# Altium schematic sheet Multiplier.SchDoc
size A; SheetNumber: 3; SheetTotal: 6
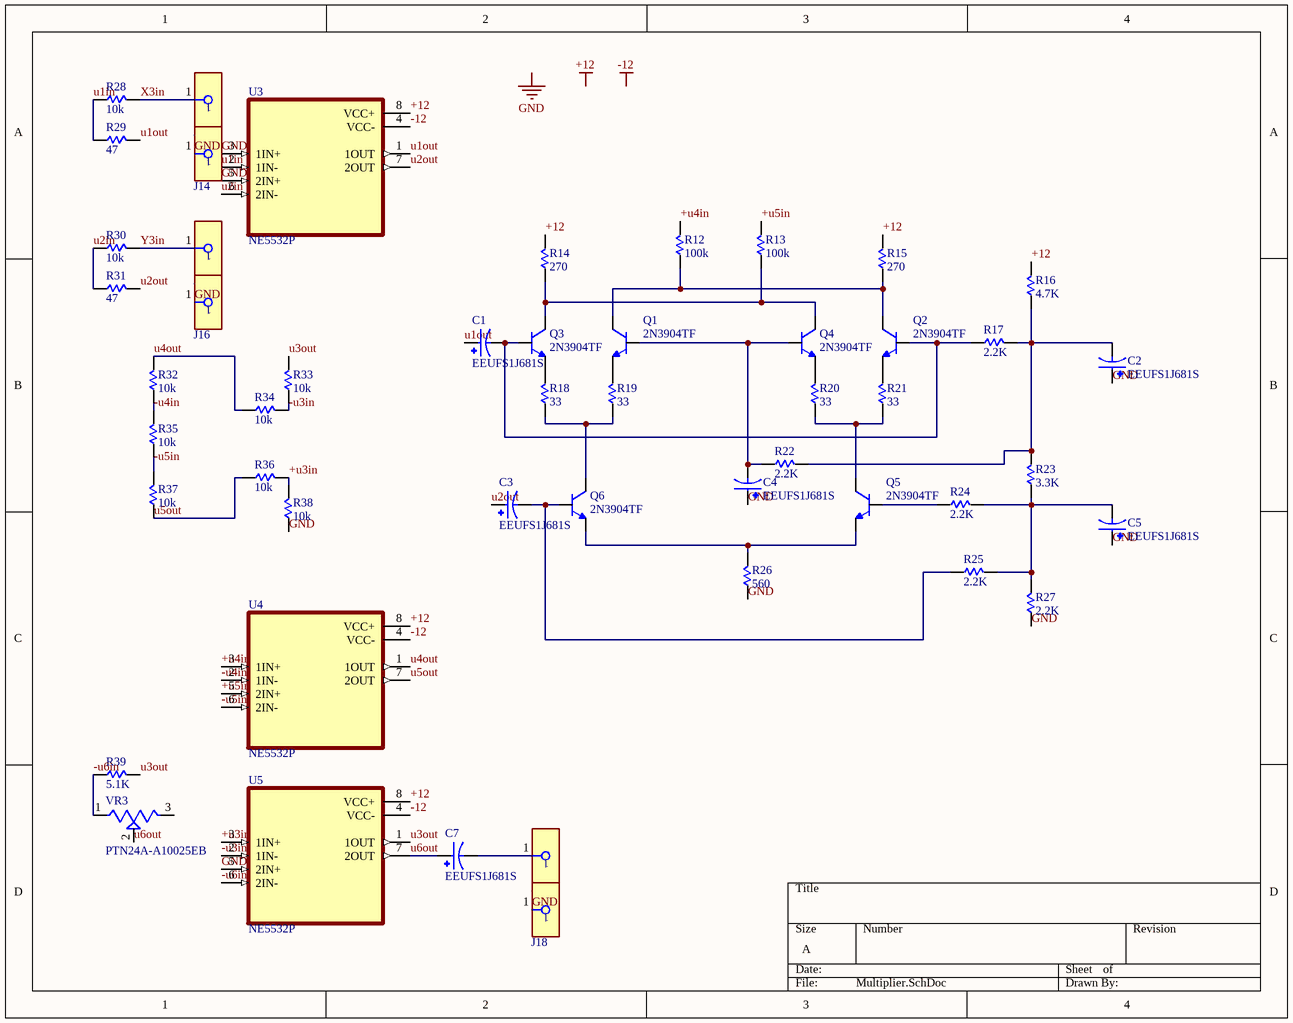
[diagram p0: Multiplier.SchDoc]

## Parts
C1  EEUFS1J681S  [CAPPRD250W50D630H1250]
C2  EEUFS1J681S  [CAPPRD250W50D630H1250]
C3  EEUFS1J681S  [CAPPRD250W50D630H1250]
C4  EEUFS1J681S  [CAPPRD250W50D630H1250]
C5  EEUFS1J681S  [CAPPRD250W50D630H1250]
C7  EEUFS1J681S  [CAPPRD250W50D630H1250]
J13  1581-5  [FP-1581-5-MFG]  (value not drawn)
J14  1581-5  [FP-1581-5-MFG]  (value not drawn)
J15  1581-5  [FP-1581-5-MFG]  (value not drawn)
J16  1581-5  [FP-1581-5-MFG]  (value not drawn)
J17  1581-5  [FP-1581-5-MFG]  (value not drawn)
J18  1581-5  [FP-1581-5-MFG]  (value not drawn)
Q1  2N3904TF  [TO92254P520H877-3]
Q2  2N3904TF  [TO92254P520H877-3]
Q3  2N3904TF  [TO92254P520H877-3]
Q4  2N3904TF  [TO92254P520H877-3]
Q5  2N3904TF  [TO92254P520H877-3]
Q6  2N3904TF  [TO92254P520H877-3]
R12  value 100k  [RESAD1100W55L680D260]  (hidden comment: MFR-25FBF52-1K)
R13  value 100k  [RESAD1100W55L680D260]  (hidden comment: MFR-25FBF52-1K)
R14  value 270  [RESAD1100W55L680D260]  (hidden comment: MFR-25FBF52-1K)
R15  value 270  [RESAD1100W55L680D260]  (hidden comment: MFR-25FBF52-1K)
R16  value 4.7K  [RESAD1100W55L680D260]  (hidden comment: MFR-25FBF52-1K)
R17  value 2.2K  [RESAD1100W55L680D260]  (hidden comment: MFR-25FBF52-1K)
R18  value 33  [RESAD1100W55L680D260]  (hidden comment: MFR-25FBF52-1K)
R19  value 33  [RESAD1100W55L680D260]  (hidden comment: MFR-25FBF52-1K)
R20  value 33  [RESAD1100W55L680D260]  (hidden comment: MFR-25FBF52-1K)
R21  value 33  [RESAD1100W55L680D260]  (hidden comment: MFR-25FBF52-1K)
R22  value 2.2K  [RESAD1100W55L680D260]  (hidden comment: MFR-25FBF52-1K)
R23  value 3.3K  [RESAD1100W55L680D260]  (hidden comment: MFR-25FBF52-1K)
R24  value 2.2K  [RESAD1100W55L680D260]  (hidden comment: MFR-25FBF52-1K)
R25  value 2.2K  [RESAD1100W55L680D260]  (hidden comment: MFR-25FBF52-1K)
R26  value 560  [RESAD1100W55L680D260]  (hidden comment: MFR-25FBF52-1K)
R27  value 2.2K  [RESAD1100W55L680D260]  (hidden comment: MFR-25FBF52-1K)
R28  value 10k  [RESAD1100W55L680D260]  (hidden comment: MFR-25FBF52-1K)
R29  value 47  [RESAD1100W55L680D260]  (hidden comment: MFR-25FBF52-1K)
R30  value 10k  [RESAD1100W55L680D260]  (hidden comment: MFR-25FBF52-1K)
R31  value 47  [RESAD1100W55L680D260]  (hidden comment: MFR-25FBF52-1K)
R32  value 10k  [RESAD1100W55L680D260]  (hidden comment: MFR-25FBF52-1K)
R33  value 10k  [RESAD1100W55L680D260]  (hidden comment: MFR-25FBF52-1K)
R34  value 10k  [RESAD1100W55L680D260]  (hidden comment: MFR-25FBF52-1K)
R35  value 10k  [RESAD1100W55L680D260]  (hidden comment: MFR-25FBF52-1K)
R36  value 10k  [RESAD1100W55L680D260]  (hidden comment: MFR-25FBF52-1K)
R37  value 10k  [RESAD1100W55L680D260]  (hidden comment: MFR-25FBF52-1K)
R38  value 10k  [RESAD1100W55L680D260]  (hidden comment: MFR-25FBF52-1K)
R39  value 5.1K  [RESAD1100W55L680D260]  (hidden comment: MFR-25FBF52-1K)
U3  NE5532P  [DIP794W45P254L959H508Q8]
U4  NE5532P  [DIP794W45P254L959H508Q8]
U5  NE5532P  [DIP794W45P254L959H508Q8]
VR3  PTN24A-A10025EB  [TRIM_PTN24A-A10025EB]

## Nets
+12: R14.2 R15.2 R16.2 U3.8(VCC+) U4.8(VCC+) U5.8(VCC+)
-12: U3.4(VCC-) U4.4(VCC-) U5.4(VCC-)
GND: C2.P C4.P C5.P J14.1 J16.1 J18.1 R26.1 R27.1 R38.1 U3.3(1IN+) U3.5(2IN+) U5.5(2IN+)
+u3in: R36.2 R38.2 U5.3(1IN+)
+u4in: R12.2 U4.3(1IN+)
+u5in: R13.2 U4.5(2IN+)
-u3in: R33.1 R34.2 U5.2(1IN-)
-u4in: R32.1 R35.2 U4.2(1IN-)
-u5in: R35.1 R37.2 U4.6(2IN-)
-u6in: R39.1 U5.6(2IN-) VR3.1
u1in: R28.1 R29.1 U3.2(1IN-)
u1out: C1.P R29.2 U3.1(1OUT)
u2in: R30.1 R31.1 U3.6(2IN-)
u2out: C3.P R31.2 U3.7(2OUT)
u3out: R33.2 R39.2 U5.1(1OUT)
u4out: R32.2 R34.1 U4.1(1OUT)
u5out: R36.1 R37.1 U4.7(2OUT)
u6out: C7.P U5.7(2OUT) VR3.2
X3in: J13.1 R28.2
Y3in: J15.1 R30.2
NetC1_N: C1.N Q2.2(B) Q3.2(B) R17.1
NetC2_N: C2.N R16.1 R17.2 R22.2 R23.2
NetC3_N: C3.N Q6.2(B) R25.1
NetC4_N: C4.N Q1.2(B) Q4.2(B) R22.1
NetC5_N: C5.N R23.1 R24.2 R25.2 R27.2
NetC7_N: C7.N J17.1
NetQ1_1: Q1.1(E) R19.2
NetQ1_3: Q1.3(C) Q2.3(C) R12.1 R15.1
NetQ2_1: Q2.1(E) R21.2
NetQ3_1: Q3.1(E) R18.2
NetQ3_3: Q3.3(C) Q4.3(C) R13.1 R14.1
NetQ4_1: Q4.1(E) R20.2
NetQ5_1: Q5.1(E) Q6.1(E) R26.2
NetQ5_2: Q5.2(B) R24.1
NetQ5_3: Q5.3(C) R20.1 R21.1
NetQ6_3: Q6.3(C) R18.1 R19.1

Not connected (* = marked no-connect by the designer): VR3 3

## Notes on the sheet
- Labels drawn without touching a wire or pin: +12, -12, GND

## Library data of the parts
C1-C5 C7 = EEUFS1J681S: CAP ALUM 680UF 20% 63V THRU HOLE; MP: EEU-FS1J681S; MF: Panasonic Electronic Components; Package: RADIAL-2 Panasonic; Availability: In Stock; SnapEDA_Link: https://www.snapeda.com/parts/EEU-FS1J681S/Panasonic/view-part/5562022/?ref=snap; Price: None; Check_prices: https://www.snapeda.com/parts/EEU-FS1J681S/Panasonic/view-part/5562022/?ref=eda; Value: *
J13-J18 = CMP-73906-000011-1: CONN BANANA JACK TURRET GREEN; Body Material: PC; Number of Contacts: 1; Max Current Rating: 15A; Voltage Rating (AC): 30V; Insulation: Mating End Insulated; Voltage Rating: 2.5kV; Voltage Rating (DC): 60V; Gender: Female; Height: 0.25inch; Mount: Panel; RoHS Compliant: Yes; Length: 1.22inch; Orientation: Straight; Diameter: 4.22mm; Lead Free: Lead Free; Package Quantity: 1; Termination: Turret; Current Rating: 15A; Packaging: Bag; Series: 1581; REACH SVHC: No SVHC; Number of Positions: 1; Contact Plating: Tin; Housing Color: Green; Contact Material: Brass; Insulation Material: Polycarbonate; Weight: 0.126lb; Number of Ports: 1; Color: Green; Housing Material: Polycarbonate; Width: 4inch
Q1-Q6 = 2N3904TF: Transistor General Purpose BJT NPN 40 Volt 0.2 Amp 3-Pin TO-92 Tape And Reel; MF: Fairchild Semiconductor; SnapEDA_Link: https://www.snapeda.com/parts/2N3904TF/Fairchild+Imaging/view-part/?ref=snap; Package: TO-92-3 ON Semiconductor; Value: *; MP: 2N3904TF; Check_prices: https://www.snapeda.com/parts/2N3904TF/Fairchild+Imaging/view-part/?ref=eda
R12-R39 = MFR-25FBF52-1K: 1.07 kOhms Â±1% 0.25W, 1/4W Through Hole Resistor Axial - Metal Film; MF: Yageo; SnapEDA_Link: https://www.snapeda.com/parts/MFR-25FBF52-1K/Yageo/view-part/?ref=snap; Package: RADIAL-2 YAGEO; MP: MFR-25FBF52-1K; Check_prices: https://www.snapeda.com/parts/MFR-25FBF52-1K/Yageo/view-part/?ref=eda
U3-U5 = NE5532P: Dual, 30-V, 10-MHz, low-noise operational amplifier for audio applications; MF: Texas Instruments; SnapEDA_Link: https://www.snapeda.com/parts/NE5532P/Texas+Instruments/view-part/?ref=snap; Package: PDIP-8 Texas; Value: *; MP: NE5532P; Check_prices: https://www.snapeda.com/parts/NE5532P/Texas+Instruments/view-part/?ref=eda
VR3 = PTN24A-A10025EB: 100k Ohm 1 Gang Linear Panel Mount Potentiometer 1.0 Turns Carbon 0.5W, 1/2W PC Pins; MF: Same Sky; SnapEDA_Link: https://www.snapeda.com/parts/PTN24A-A10025EB/Same+Sky/view-part/?ref=snap; Package: Package; Value: *; MP: PTN24A-A10025EB; Check_prices: https://www.snapeda.com/parts/PTN24A-A10025EB/Same+Sky/view-part/?ref=eda